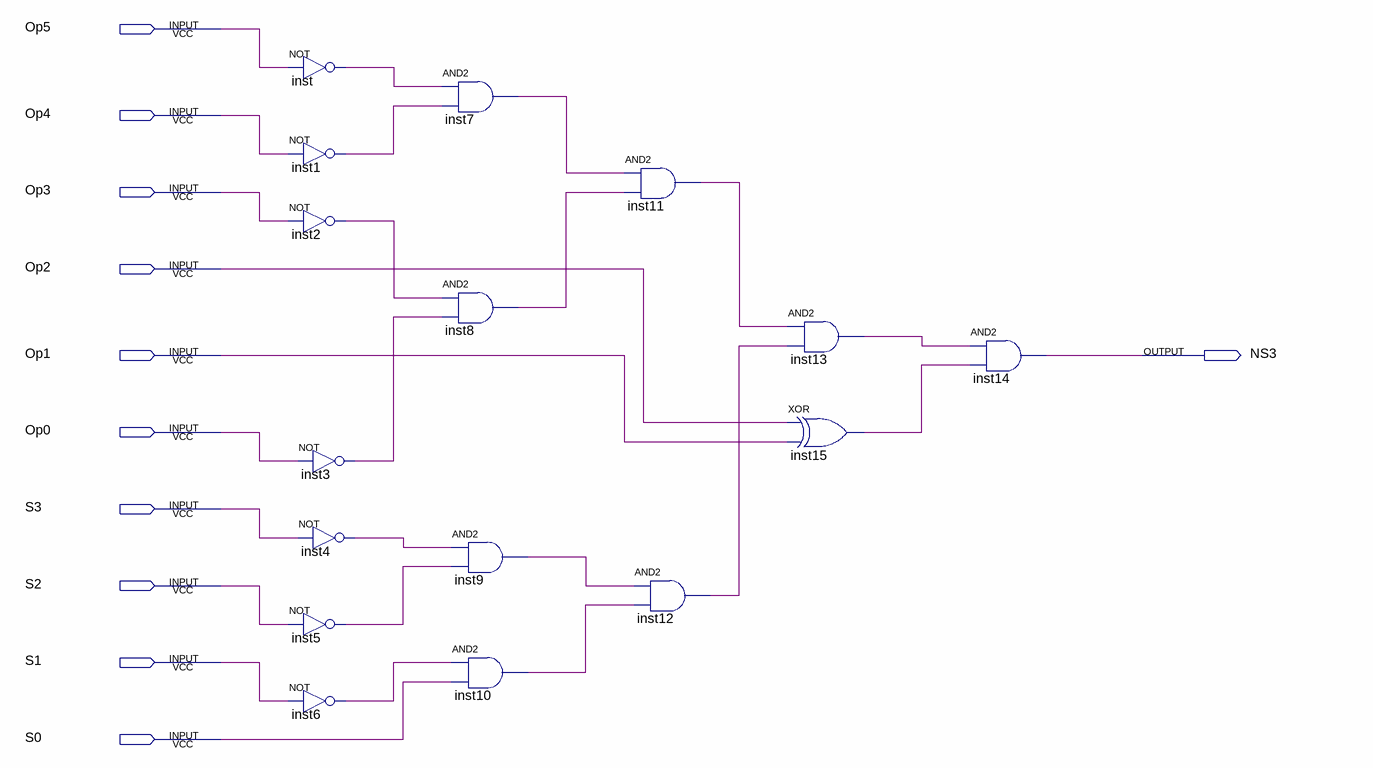
[diagram p0: schematic sheet]
// Quartus schematic NS3.bdf as structural Verilog: 16 symbols, 11 pins
module NS3 (
  input  Op5,
  input  Op4,
  input  Op3,
  input  Op2,
  input  Op1,
  input  Op0,
  input  S3,
  input  S2,
  input  S1,
  input  S0,
  output NS3
);

  wire inst1_out, inst2_out, inst3_out, inst4_out, inst5_out, inst6_out, inst7_out, inst8_out, inst9_out,
       inst10_out, inst11_out, inst12_out, inst13_out, inst15_out, inst_out;

  not inst (inst_out, Op5);
  not inst1 (inst1_out, Op4);
  not inst2 (inst2_out, Op3);
  not inst3 (inst3_out, Op0);
  not inst4 (inst4_out, S3);
  not inst5 (inst5_out, S2);
  not inst6 (inst6_out, S1);
  and inst7 (inst7_out, inst_out, inst1_out);
  and inst8 (inst8_out, inst2_out, inst3_out);
  and inst9 (inst9_out, inst4_out, inst5_out);
  and inst10 (inst10_out, inst6_out, S0);
  and inst11 (inst11_out, inst7_out, inst8_out);
  and inst12 (inst12_out, inst9_out, inst10_out);
  and inst13 (inst13_out, inst11_out, inst12_out);
  xor inst15 (inst15_out, Op2, Op1);
  and inst14 (NS3, inst13_out, inst15_out);
endmodule
